# EAGLE design SmartLed (EAGLE 9.6.2)
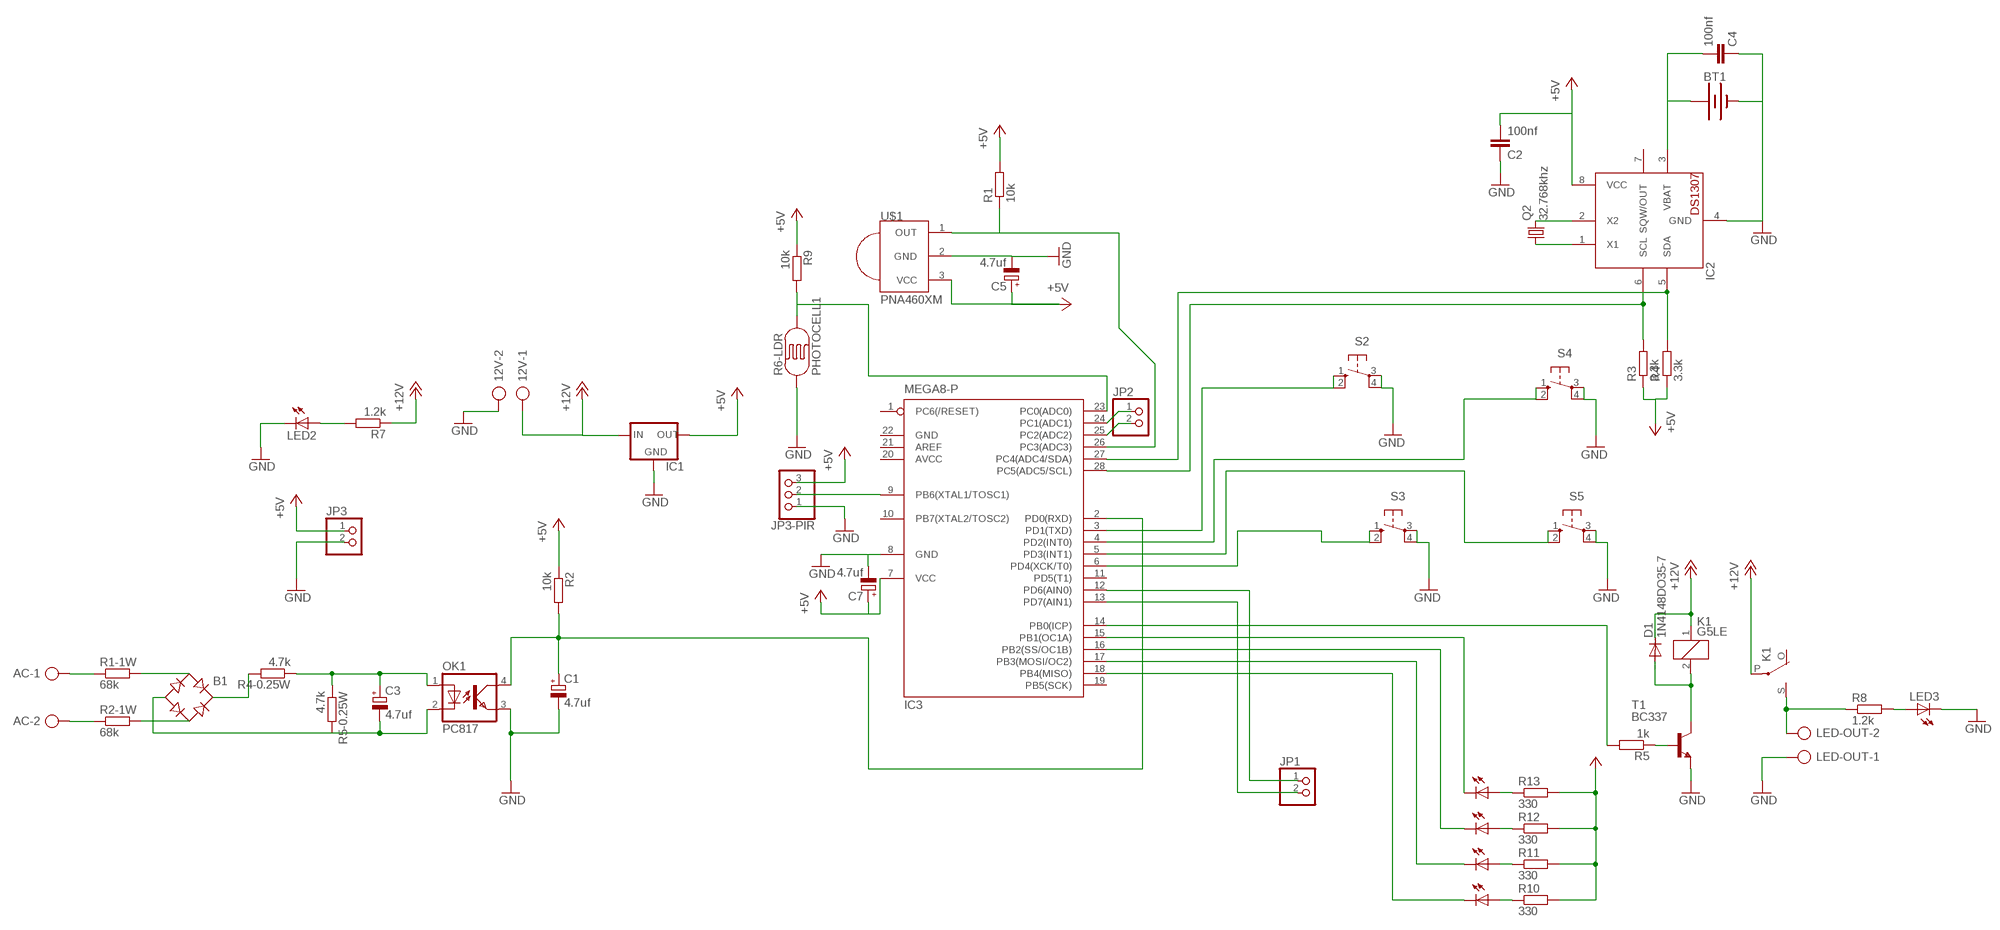
[diagram p0: schematic, sheet 1]

## Parts
12V  AK500/2  [AK500/2]
AC  AK500/2  [AK500/2]
B1  RB1A  [RB1A]
BT1  BATTERY-20MM_PTH  [BATTCOM_20MM_PTH]
C1  4.7uf  CPOL-EUE2.5-5  [E2,5-5]
C2  100nf  C-EU025-025X050  [C025-025X050]
C3  4.7uf  CPOL-EUE2.5-5  [E2,5-5]
C4  100nf  C-EU025-025X050  [C025-025X050]
C5  4.7uf  CPOL-EUE2.5-5  [E2,5-5]
C7  4.7uf  CPOL-EUE2.5-5  [E2,5-5]
D1  1N4148DO35-7  [DO35-7]
IC1  78XXL  [78XXL]
IC2  DS1307  [DIL08]
IC3  MEGA8-P  [DIL28-3]
JP1  PINHD-1X2  [1X02]
JP2  PINHD-1X2  [1X02]
JP3  PINHD-1X2  [1X02]
JP3-PIR  PINHD-1X3  [1X03]
K1  G5LE  [G5LE]
LED2  LED3MM  [LED3MM]
LED3  LED3MM  [LED3MM]
LED5  LED3MM  [LED3MM]
LED6  LED3MM  [LED3MM]
LED7  LED3MM  [LED3MM]
LED8  LED3MM  [LED3MM]
LED-OUT  AK500/2  [AK500/2]
OK1  PC817  [DIL04]
Q2  32.768khz  CRYSTALTC26V  [TC26V]
R1  10k  R-EU_0207/10  [0207/10]
R1-1W  68k  R-EU_0411/15  [0411/15]
R2  10k  R-EU_0207/10  [0207/10]
R2-1W  68k  R-EU_0411/15  [0411/15]
R3  3.3k  R-EU_0207/10  [0207/10]
R4  3.3k  R-EU_0207/10  [0207/10]
R4-0.25W  4.7k  R-EU_0207/10  [0207/10]
R5  1k  R-EU_0207/10  [0207/10]
R5-0.25W  4.7k  R-EU_0207/10  [0207/10]
R6-LDR  PHOTOCELL1  [LDR_OFFBOARD]
R7  1.2k  R-EU_0207/10  [0207/10]
R8  1.2k  R-EU_0207/10  [0207/10]
R9  10k  R-EU_0207/10  [0207/10]
R10  330  R-EU_0207/10  [0207/10]
R11  330  R-EU_0207/10  [0207/10]
R12  330  R-EU_0207/10  [0207/10]
R13  330  R-EU_0207/10  [0207/10]
S2  10-XX  [B3F-10XX]
S3  10-XX  [B3F-10XX]
S4  10-XX  [B3F-10XX]
S5  10-XX  [B3F-10XX]
T1  BC337  [TO92]
U$1  PNA460XM  [PNA460XM]

## Nets
+5V: C2.2 C5.+ C7.+ IC1.OUT IC2.8(VCC) IC3.7(VCC) JP3-PIR.3 JP3.1 R1.2 R2.1 R3.1 R4.1 R9.1 R10.2 R11.2 R12.2 R13.2 U$1.3(VCC)
+12V [power]: 12V.1 D1.C IC1.IN K1.1 K1.P(2:P) R7.1
GND: 12V.2 BT1.2(-) C1.- C2.1 C4.1 C5.- C7.- IC1.GND IC2.4(GND) IC3.8(GND) JP3-PIR.1 JP3.2 LED2.K(C) LED3.K(C) LED-OUT.1 OK1.3(EMIT) R6-LDR.1 S2.3(P) S2.4(P1) S3.3(P) S3.4(P1) S4.3(P) S4.4(P1) S5.3(P) S5.4(P1) T1.1(E) U$1.2(GND)
N$1: AC.1 R1-1W.1
N$2: AC.2 R2-1W.1
N$3: B1.AC1 R1-1W.2
N$4: B1.AC2 R2-1W.2
N$5: B1.+ R4-0.25W.2
N$6: C3.+ OK1.1(A) R4-0.25W.1 R5-0.25W.1
N$7: B1.- C3.- OK1.2(C) R5-0.25W.2
N$8 [power]: K1.S(2:S) LED-OUT.2 R8.1
N$9: R5.1 T1.2(B)
N$10: IC3.14(PB0(ICP)) R5.2
N$11: C1.+ IC3.2(PD0(RXD)) OK1.4(COL) R2.2
N$12: IC2.6(SCL) IC3.28(PC5(ADC5/SCL)) R3.2
N$13: IC2.5(SDA) IC3.27(PC4(ADC4/SDA)) R4.2
N$14: D1.A K1.2 T1.3(C)
N$15: LED2.A R7.2
N$16: LED3.A R8.2
N$17: IC3.15(PB1(OC1A)) LED8.K(C)
N$18: LED8.A R13.1
N$19: IC3.9(PB6(XTAL1/TOSC1)) JP3-PIR.2
N$20: IC3.16(PB2(SS/OC1B)) LED7.K(C)
N$21: IC2.1(X1) Q2.1
N$22: IC2.2(X2) Q2.2
N$23: LED7.A R12.1
N$24: IC3.17(PB3(MOSI/OC2)) LED6.K(C)
N$25: LED6.A R11.1
N$26: IC3.18(PB4(MISO)) LED5.K(C)
N$27: LED5.A R10.1
N$28: IC3.3(PD1(TXD)) S2.1(S) S2.2(S1)
N$30: IC3.24(PC1(ADC1)) JP2.1
N$31: IC3.6(PD4(XCK/T0)) S3.1(S) S3.2(S1)
N$32: IC3.4(PD2(INT0)) S4.1(S) S4.2(S1)
N$33: IC3.5(PD3(INT1)) S5.1(S) S5.2(S1)
N$34: IC3.25(PC2(ADC2)) JP2.2
N$35: IC3.23(PC0(ADC0)) R6-LDR.2 R9.2
N$37: IC3.12(PD6(AIN0)) JP1.1
N$39: IC3.13(PD7(AIN1)) JP1.2
N$44: BT1.1(+) C4.2 IC2.3(VBAT)
N$46: IC3.26(PC3(ADC3)) R1.1 U$1.1(OUT)
Unconnected: IC2.7(SQW/OUT) IC3.1(PC6(/RESET)) IC3.10(PB7(XTAL2/TOSC2)) IC3.11(PD5(T1)) IC3.19(PB5(SCK)) IC3.21(AREF) K1.O(2:O)

## Power pins joined to a net without a drawn wire
AVCC: IC3.20(AVCC)
GND: IC3.22(GND)

## Library data of the parts
12V AC LED-OUT = con-ptr500:AK500/2: CONNECTOR; OC_FARNELL: unknown; OC_NEWARK: unknown
B1 = rectifier:RB1A: RECTIFIER 1 A
BT1 = SparkFun-Batteries:BATTERY: Battery - Single Cell A variety of battery chemistries, sizes, and footprints. Device List: 20MM_PTH - Coin Cell Battery Holder - 20mm (PTH) <https://www.sparkfun.com/products/783> 6.8MM_PTH - Coin Cell Battery Holder - 6.8MM(SMD) <https://www.digikey.com/product-detail/en/seiko-instruments/MS621FE-FL11E/728-1057-ND/1889208?WT.srch=1&gclid=CNOQ5a6LzdQCFZS2wAodXCkE0g> 12MM_SMD - Coin Cell Battery Holder - 12mm (SMD) <https://www.sparkfun.com/products/10592> 12MM_PTH - Coin Cell Battery Holder - 12mm (PTH) <https://www.sparkfun.com/products/7948> 20MM_SMD - 20mm Coin Cell Battery Holder (SMD) (2 legs) Used on the Big Time Watch Kit <https://www.sparkfun.com/products/11734> 20MM_SMD_4LEGS - Coin Cell Battery Holder - 20mm (SMD) <https://www.sparkfun.com/products/11892> 20MM_SMD_4LEGS_OVERPASTE - Coin Cell Battery Holder - 20mm (SMD) <https://www.sparkfun.com/products/11892> (Over-paste on the legs) 24.5MM_PTH - Coin Cell Battery Holder - 24.5mm (PTH) <https://www.sparkfun.com/products/8863> 9V - 9V Battery Holder - PC Mount Used on the SparkFun SparkPunk Sound Kit <https://www.sparkfun.com/products/11177> and SparkFun SparkPunk Sequencer Kit <https://www.sparkfun.com/products/12707> 18650 - Battery Holder - 18650 (PTH) <https://www.sparkfun.com/products/13113> AA - Battery Holder - 1xAA (PTH) <https://www.sparkfun.com/products/7949> AAA - Battery Holder - 1xAAA (PTH) <https://www.sparkfun.com/products/12718> AA_KIT - Battery Holder - 1xAA (PTH) <https://www.sparkfun.com/products/7949> Special kit package - pads only have exposed copper on one side of the board. AAA_KIT - Battery Holder - 1xAAA (PTH) <https://www.sparkfun.com/products/12718> Special kit package - pads only have exposed copper on one side of the board.; PROD_ID: BATT-09031; SF_SKU: PRT-00783
C1 C3 C5 C7 = rcl:CPOL-EU: POLARIZED CAPACITOR, European symbol
C2 C4 = rcl:C-EU: CAPACITOR, European symbol
D1 = diode:1N4148: DIODE high speed (Philips)
IC1 = v-reg:78XXL: VOLTAGE REGULATOR
IC2 = adafruit:DS1307: DS1307 Real time clock (RTC) with battery backup ability. Talk to it via i2c
IC3 = atmel:MEGA8-P: MICROCONTROLLER 8 Kbytes FLASH, 1 kbytes SRAM, 512 bytes EEPROM, USART, 4-channel 10 bit ADC, 2-channel 8 bit ADC Pin compatible with Atmega48, ATMega88, ATMega168 Source: avr.lbr; OC_FARNELL: unknown; OC_NEWARK: unknown
JP1-JP3 = pinhead:PINHD-1X2: PIN HEADER
JP3-PIR = pinhead:PINHD-1X3: PIN HEADER
K1 = relay:G5LE: RELAY 1 x switch, 10 A/120 V AC, 8 A/30 V DC, Omron; OC_FARNELL: unknown; OC_NEWARK: unknown
LED2 LED3 LED5-LED8 = led:LED: LED OSRAM: - CHIPLED LG R971, LG N971, LY N971, LG Q971, LY Q971, LO R971, LY R971 LH N974, LH R974 LS Q976, LO Q976, LY Q976 LO Q996 - Hyper CHIPLED LW Q18S LB Q993, LB Q99A, LB R99A - SideLED LS A670, LO A670, LY A670, LG A670, LP A670 LB A673, LV A673, LT A673, LW A673 LH A674 LY A675 LS A676, LA A676, LO A676, LY A676, LW A676 LS A679, LY A679, LG A679 - Hyper Micro SIDELED® LS Y876, LA Y876, LO Y876, LY Y876 LT Y87S - SmartLED LW L88C, LW L88S LB L89C, LB L89S, LG L890 LS L89K, LO L89K, LY L89K LS L896, LA L896, LO L896, LY L896 - TOPLED LS T670, LO T670, LY T670, LG T670, LP T670 LSG T670, LSP T670, LSY T670, LOP T670, LYG T670 LG T671, LOG T671, LSG T671 LB T673, LV T673, LT T673, LW T673 LH T674 LS T676, LA T676, LO T676, LY T676, LB T676, LH T676, LSB T676, LW T676 LB T67C, LV T67C, LT T67C, LS T67K, LO T67K, LY T67K, LW E67C LS E67B, LA E67B, LO E67B, LY E67B, LB E67C, LV E67C, LT E67C LW T67C LS T679, LY T679, LG T679 LS T770, LO T770, LY T770, LG T770, LP T770 LB T773, LV T773, LT T773, LW T773 LH T774 LS E675, LA E675, LY E675, LS T675 LS T776, LA T776, LO T776, LY T776, LB T776 LHGB T686 LT T68C, LB T68C - Hyper Mini TOPLED® LB M676 - Mini TOPLED Santana® LG M470 LS M47K, LO M47K, LY M47K Source: http://www.osram.convergy.de LUXEON: - LUMILED® LXK2-PW12-R00, LXK2-PW12-S00, LXK2-PW14-U00, LXK2-PW14-V00 LXK2-PM12-R00, LXK2-PM12-S00, LXK2-PM14-U00 LXK2-PE12-Q00, LXK2-PE12-R00, LXK2-PE12-S00, LXK2-PE14-T00, LXK2-PE14-U00 LXK2-PB12-K00, LXK2-PB12-L00, LXK2-PB12-M00, LXK2-PB14-N00, LXK2-PB14-P00, LXK2-PB14-Q00 LXK2-PR12-L00, LXK2-PR12-M00, LXK2-PR14-Q00, LXK2-PR14-R00 LXK2-PD12-Q00, LXK2-PD12-R00, LXK2-PD12-S00 LXK2-PH12-R00, LXK2-PH12-S00 LXK2-PL12-P00, LXK2-PL12-Q00, LXK2-PL12-R00 Source: www.luxeon.com KINGBRIGHT: KA-3528ASYC Source: www.kingbright.com
OK1 = optocoupler:PC817: SHARP OPTO COUPLER; MPN: PC817X4J000F; OC_FARNELL: 9707727; OC_NEWARK: 97K7059
Q2 = crystal:CRYSTAL: CRYSTAL; OC_FARNELL: unknown; OC_NEWARK: unknown
R1 R1-1W R2 R2-1W R3 R4 R4-0.25W R5 R5-0.25W R7-R13 = rcl:R-EU_: RESISTOR, European symbol
R6-LDR = LDR:PHOTOCELL: Photo Resitor
S2-S5 = switch-omron:10-XX: OMRON SWITCH; MPN: B3F-1000; OC_FARNELL: 176432; OC_NEWARK: 36M3542
T1 = transistor:BC337: NPN TRANSISTOR
U$1 = adafruit:PNA460XM: IR 38KHz receiver PNA4602 and related receivers http://www.ladyada.net/library/pcb/eaglelibrary.html

## Net classes
0 default: width 0.61 mm, clearance 0.406 mm
1 power: width 1.016 mm, clearance 0.406 mm

## Board
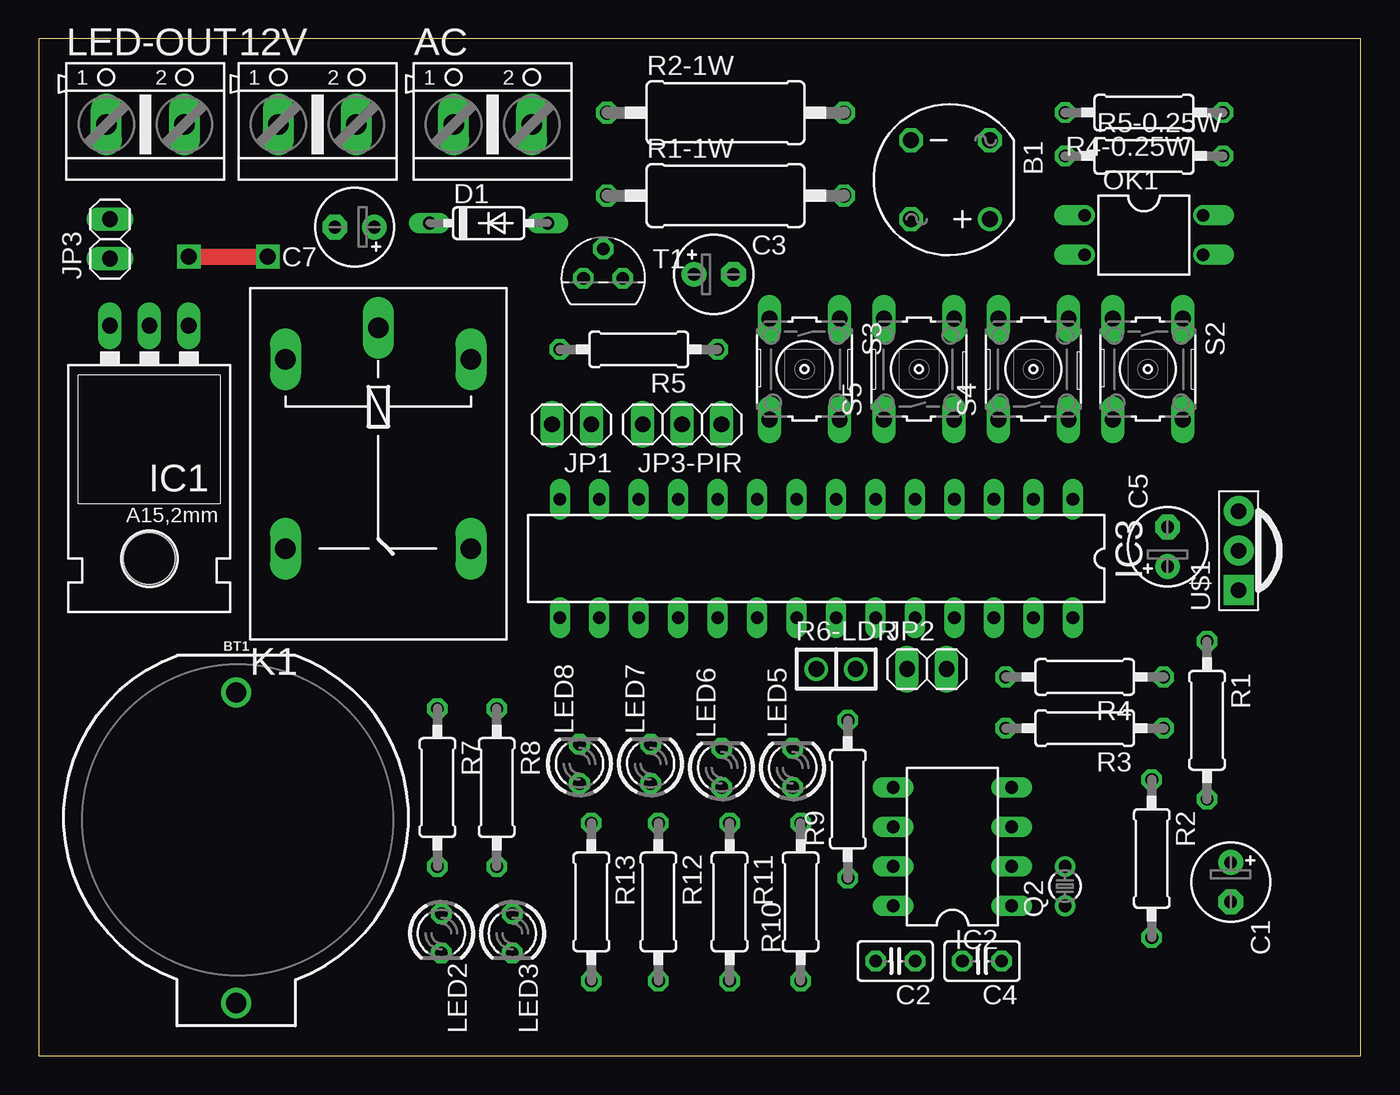
[diagram p1: board, top side]
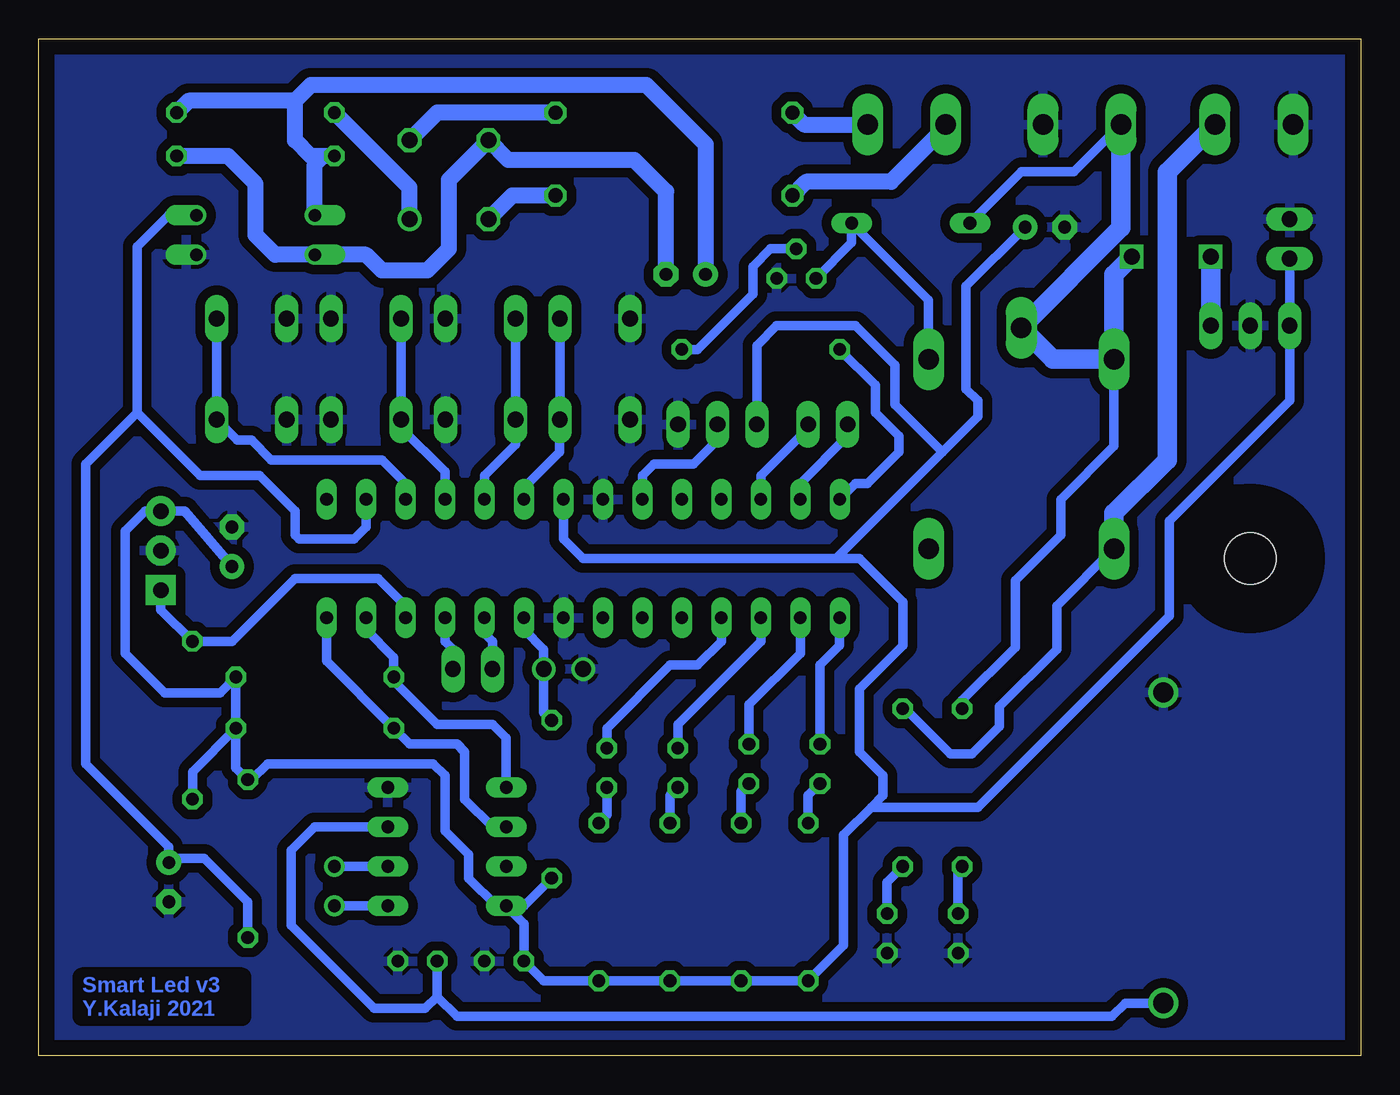
[diagram p2: board, bottom side, seen from below]

Size 85.07 x 65.46 mm. Coordinates in mm from the lower left corner, seen from the top.
Outline: 0,0 85.07,0 85.07,65.46 0,65.46 0,0
Copper layers (1*16): Top 0.035mm / dielectric 1.5mm / Bottom 0.035mm
Design rules "default *": minimum track width 24mil, minimum drill 24mil, track to track 20mil, track to pad 20mil, pad to pad 20mil, via to via 20mil, smd to smd 8mil, copper to edge 40mil, drill to drill 8mil, minimum pad ring 10mil, minimum via ring 8mil, stop-mask expansion 4mil, vias tented up to drill 0mil, thermal gap 10mil

### Footprints (pad centres in the part's own frame; a part is rotated, then mirrored left to right if it is on the bottom)
AK500/2 = drill 1.321 long: 1 -2.515,0; 2 2.515,0
RB1A = drill 1.016: + -2.54,2.54 | drill 1.016 octagon: - 2.54,-2.54; AC1 2.54,2.54; AC2 -2.54,-2.54
BATTCOM_20MM_PTH = drill 1.3: 1 11.85,0; 2 -8.15,0
E2,5-5 = drill 0.813 pad 1.6: + -1.27,0 | drill 0.813 pad 1.6 octagon: - 1.27,0
C025-025X050 = drill 0.813 octagon: 1 -1.27,0; 2 1.27,0
DO35-7 = drill 0.813 long: A 3.81,0; C -3.81,0
78XXL = drill 1.016 long: GND 0,-3.81; IN -2.54,-3.81; OUT 2.54,-3.81 | hole 3.302: 0,11.176
DIL08 = drill 0.813 long: 1 -3.81,-3.81; 2 -1.27,-3.81; 3 1.27,-3.81; 4 3.81,-3.81; 5 3.81,3.81; 6 1.27,3.81; 7 -1.27,3.81; 8 -3.81,3.81
DIL28-3 = drill 0.813 long: 1 -16.51,-3.81; 2 -13.97,-3.81; 3 -11.43,-3.81; 4 -8.89,-3.81; 5 -6.35,-3.81; 6 -3.81,-3.81; 7 -1.27,-3.81; 8 1.27,-3.81; 9 3.81,-3.81; 10 6.35,-3.81; 11 8.89,-3.81; 12 11.43,-3.81; 13 13.97,-3.81; 14 16.51,-3.81; 15 16.51,3.81; 16 13.97,3.81; 17 11.43,3.81; 18 8.89,3.81; 19 6.35,3.81; 20 3.81,3.81; 21 1.27,3.81; 22 -1.27,3.81; 23 -3.81,3.81; 24 -6.35,3.81; 25 -8.89,3.81; 26 -11.43,3.81; 27 -13.97,3.81; 28 -16.51,3.81
1X02 = drill 1.016 long: 1 -1.27,0; 2 1.27,0
1X03 = drill 1.016 long: 1 -2.54,0; 2 0,0; 3 2.54,0
G5LE = drill 1.321 long: 1 -7.493,-5.969; 2 -7.493,5.969; O 4.699,5.969; P -9.525,0; S 4.699,-5.969
LED3MM = drill 0.813 octagon: A -1.27,0; K 1.27,0
DIL04 = drill 0.813 offset: 1 -1.27,-3.81; 2 1.27,-3.81; 3 1.27,3.81; 4 -1.27,3.81
TC26V = drill 0.813: 1 -1.27,0; 2 1.27,0
0207/10 = drill 0.813 octagon: 1 -5.08,0; 2 5.08,0
0411/15 = drill 0.914 octagon: 1 -7.62,0; 2 7.62,0
LDR_OFFBOARD = drill 1.016: 1 -1.27,0; 2 1.27,0
B3F-10XX = drill 1.016 long: 1 -3.251,2.261; 2 3.251,2.261; 3 -3.251,-2.261; 4 3.251,-2.261
TO92 = drill 0.813 octagon: 1 1.27,0; 2 0,1.905; 3 -1.27,0
PNA460XM = drill 1.016 pad 1.93 square: 1 -2.54,0 | drill 1.016 pad 1.93: 2 0,0; 3 2.54,0

### Placement (x,y rotation side)
12V  17.93,59.94 0 top
AC  29.21,59.94 0 top
B1  58.67,56.39 180 top
BT1  12.7,15.24 270 top
C1  76.71,11.18 270 top
C2  55.12,6.1 180 top
C3  43.43,50.29 0 top
C4  60.71,6.1 180 top
C5  72.64,32.77 90 top
C7  20.32,53.34 180 top
D1  28.96,53.59 0 top
IC1  7.11,43.18 180 top
IC2  58.8,13.46 90 top
IC3  50.04,32 180 top
JP1  34.29,40.64 180 top
JP2  57.15,24.89 0 top
JP3  4.57,52.58 90 top
JP3-PIR  41.4,40.64 180 top
K1  21.84,37.34 270 top
LED2  25.91,7.87 270 top
LED3  30.48,7.87 270 top
LED5  48.51,18.54 90 top
LED6  43.94,18.54 90 top
LED7  39.37,18.8 90 top
LED8  34.8,18.8 90 top
LED-OUT  6.86,59.94 0 top
OK1  71.12,52.83 270 top
Q2  66.04,10.92 90 top
R1  75.18,21.59 270 top
R1-1W  44.2,55.37 0 top
R2  71.63,12.7 270 top
R2-1W  44.2,60.71 0 top
R3  67.31,21.08 180 top
R4  67.31,24.38 180 top
R4-0.25W  71.12,60.71 180 top
R5  38.61,45.47 180 top
R5-0.25W  71.12,57.91 0 top
R6-LDR  51.31,24.89 0 top
R7  25.65,17.27 270 top
R8  29.46,17.27 270 top
R9  52.07,16.51 90 top
R10  49.02,9.91 270 top
R11  44.45,9.91 270 top
R12  39.88,9.91 270 top
R13  35.56,9.91 270 top
S2  71.37,44.2 270 top
S3  49.28,44.2 270 top
S4  64.01,44.2 90 top
S5  56.64,44.2 90 top
T1  36.32,50.04 0 top
U$1  77.22,32.51 90 top

### Tracks (layer width: path | path; a pad name or v marks a point on that pad's centre or on a via)
+5V
  Bottom 0.61: 33.78,32 32.26,32 29.46,29.21 29.46,26.42 32.26,23.62 32.26,19.56 30.73,18.03 30.73,16.76 31.5,16 | 33.78,32 50.04,32 51.31,33.27 IC3.7 | 26.92,38.86 24.64,41.15 24.64,42.16 25.4,42.93 25.4,49.53 C7.+ | 26.92,38.86 33.78,32 | C5.+ 75.69,35.05 U$1.3 78.23,35.05 79.5,33.78 79.5,25.91 76.96,23.37 73.41,23.37 R4.1 R3.1 | R3.1 75.18,18.29 R1.2 | 53.97,6.22 C2.2 | 26.92,38.86 29.97,41.91 29.97,44.45 32.51,46.99 37.59,46.99 38.86,45.72 JP3-PIR.3 | R3.1 72.39,18.54 R2.1 71.37,17.78 70.36,18.8 59.69,18.8 58.93,18.03 58.93,14.48 57.4,12.95 57.4,11.43 55.63,9.65 IC2.8 | JP3.1 IC1.OUT 4.57,42.16 12.32,34.42 12.32,28.32 24.64,16 31.5,16 | IC2.8 53.97,9.65 | IC2.8 53.85,8.51 C2.2 | C2.2 52.58,4.83 R10.2 R11.2 R12.2 R13.2 33.27,7.11 33.27,14.22 31.5,16 | R9.1 53.85,9.65 IC2.8
+12V  (via drill 1.02)
  Top 1.016: v9.65,51.43 v14.73,51.43
  Bottom 0.61: 15.37,59.89 12V.1 18.47,56.9 21.84,56.9 D1.C | R7.1 25.65,22.86 22.23,26.29 22.23,30.61 19.3,33.53 19.3,35.81 15.88,39.24 K1.1
  Bottom 1.016: 15.77,44.73 K1.1
  Bottom 1.27: 12V.1 15.42,53.29 K1.P 19.81,44.83 K1.1 15.88,50.29 v14.73,51.43 | v9.65,51.43 IC1.IN
GND
  pour Bottom (isolate 0.61): 0,65.28 87.38,65.02 87.12,-4.83 -0.25,-4.57
N$1
  Bottom 1.016: AC.1 26.7,59.79 30.23,56.26 35.69,56.26 R1-1W.1
N$2
  Bottom 1.016: AC.2 35.81,59.94 R2-1W.1
N$3
  Bottom 1.016: R1-1W.2 54.61,55.37 B1.AC1
N$4
  Bottom 1.016: R2-1W.2 59.44,60.71 B1.AC2
N$5
  Bottom 1.016: B1.+ 61.21,55.88 R4-0.25W.2
N$6
  Bottom 1.016: R5-0.25W.1 66.8,57.91 | 66.8,57.91 67.56,57.91 68.58,58.93 68.58,61.47 | 68.58,61.47 67.56,62.48 45.97,62.48 42.16,58.67 C3.+ | 68.58,61.47 75.44,61.47 R4-0.25W.1 | OK1.1 67.31,57.4 66.8,57.91
N$7
  Bottom 1.016: R5-0.25W.2 72.9,57.91 71.12,56.13 71.12,55.63 71.12,55.12 71.12,52.83 69.85,51.56 OK1.2 64.01,51.56 62.99,50.55 60.07,50.55 58.67,51.94 58.67,56.39 B1.- 54.86,57.66 46.74,57.66 44.7,55.63 C3.-
N$8
  Bottom 0.61: R8.1 29.34,22.35 26.42,19.43 25.02,19.43 23.24,21.21 23.24,22.48 19.56,26.16 19.56,28.96 K1.S
  Bottom 1.27: LED-OUT.2 12.45,56.87 12.45,38.35 15.88,34.93 K1.S
N$9
  Bottom 0.61: T1.2 37.97,51.94 39.12,50.8 39.12,49.02 42.67,45.47 R5.1
N$10
  Bottom 0.61: R5.2 31.24,43.18 31.24,41.4 29.72,39.88 29.72,38.86 31.75,36.83 32.51,36.83 IC3.14
N$11
  Bottom 0.61: IC3.2 64.01,34.04 64.77,33.27 68.33,33.27 68.58,33.53 68.58,35.05 70.87,37.34 74.68,37.34 78.74,41.4 | 78.74,41.4 78.74,52.07 76.71,54.1 OK1.4 | 78.74,41.4 82.04,38.1 82.04,18.8 76.71,13.46 C1.+ 76.45,12.7 74.42,12.7 71.63,9.91 R2.2
N$12
  Bottom 0.61: IC3.28 66.55,25.4 R3.2 61.21,20.07 58.17,20.07 57.66,19.56 57.66,16.51 55.88,14.73 IC2.6
N$13
  Bottom 0.61: IC3.27 64.01,27.43 62.23,25.65 R4.2 62.23,24.13 59.44,21.34 55.88,21.34 54.99,20.45 IC2.5
N$14
  Bottom 0.61: K1.2 27.81,48.64 D1.A 32.77,52.32 T1.3
N$15
  Bottom 0.61: LED2.A 25.91,11.94 R7.2
N$16
  Bottom 0.61: LED3.A 30.48,11.18 R8.2
N$17
  Bottom 0.61: IC3.15 33.53,26.42 34.8,25.15 LED8.K
N$18
  Bottom 0.61: LED8.A 35.56,16.76 R13.1
N$19
  Bottom 0.61: IC3.9 46.23,37.34 45.47,38.1 42.93,38.1 41.4,39.62 JP3-PIR.2
N$20
  Bottom 0.61: IC3.16 36.07,25.91 39.37,22.61 LED7.K
N$21
  Bottom 0.61: IC2.1 Q2.1
N$22
  Bottom 0.61: IC2.2 Q2.2
N$23
  Bottom 0.61: LED7.A 39.88,17.02 R12.1
N$24
  Bottom 0.61: IC3.17 38.61,26.67 43.94,21.34 LED6.K
N$25
  Bottom 0.61: LED6.A 44.45,16.76 R11.1
N$26
  Bottom 0.61: IC3.18 41.15,26.67 42.67,25.15 44.45,25.15 48.51,21.08 LED5.K
N$27
  Bottom 0.61: LED5.A 48.51,15.49 R10.1
N$28
  Bottom 0.61: S2.1 S2.2 | IC3.3 61.47,36.83 62.99,38.35 70.1,38.35 71.37,39.62 72.31,39.62 S2.2 | 73.58,40.89 S2.2
N$30
  Bottom 0.61: IC3.24 56.39,27.18 55.88,26.67 JP2.1
N$31
  Bottom 0.61: S3.1 S3.2 51.56,40.92 51.56,38.86 53.85,36.58 IC3.6
N$32
  Bottom 0.61: S4.2 S4.1 61.75,40.41 58.93,37.59 IC3.4 58.93,36.83
N$33
  Bottom 0.61: S5.2 S5.1 54.38,39.35 56.39,37.34 IC3.5
N$34
  Bottom 0.61: 58.93,27.43 IC3.25 58.93,26.67 58.42,26.16 JP2.2
N$35
  Bottom 0.61: IC3.23 53.85,27.43 52.58,26.16 R6-LDR.2 52.58,22.1 R9.2
N$37
  Bottom 0.61: IC3.12 38.61,37.34 35.56,40.39 JP1.1
N$39
  Bottom 0.61: IC3.13 36.07,36.83 33.02,39.88 JP1.2
N$44
  Bottom 0.61: C4.2 59.44,3.81 | BT1.1 15.15,3.39 16,2.54 58.17,2.54 59.44,3.81 | 59.44,3.81 60.2,3.05 63.5,3.05 68.83,8.38 68.83,13.21 67.31,14.73 IC2.3
N$46
  Bottom 0.61: U$1.1 77.22,28.7 R1.1 72.64,26.67 68.58,30.73 63.25,30.73 61.47,28.96 IC3.26

### Text on the board
Bottom: Smart Led v3 / Y.Kalaji 2021